# EAGLE schematic STM32F405RGT6 (EAGLE 9.6.2)
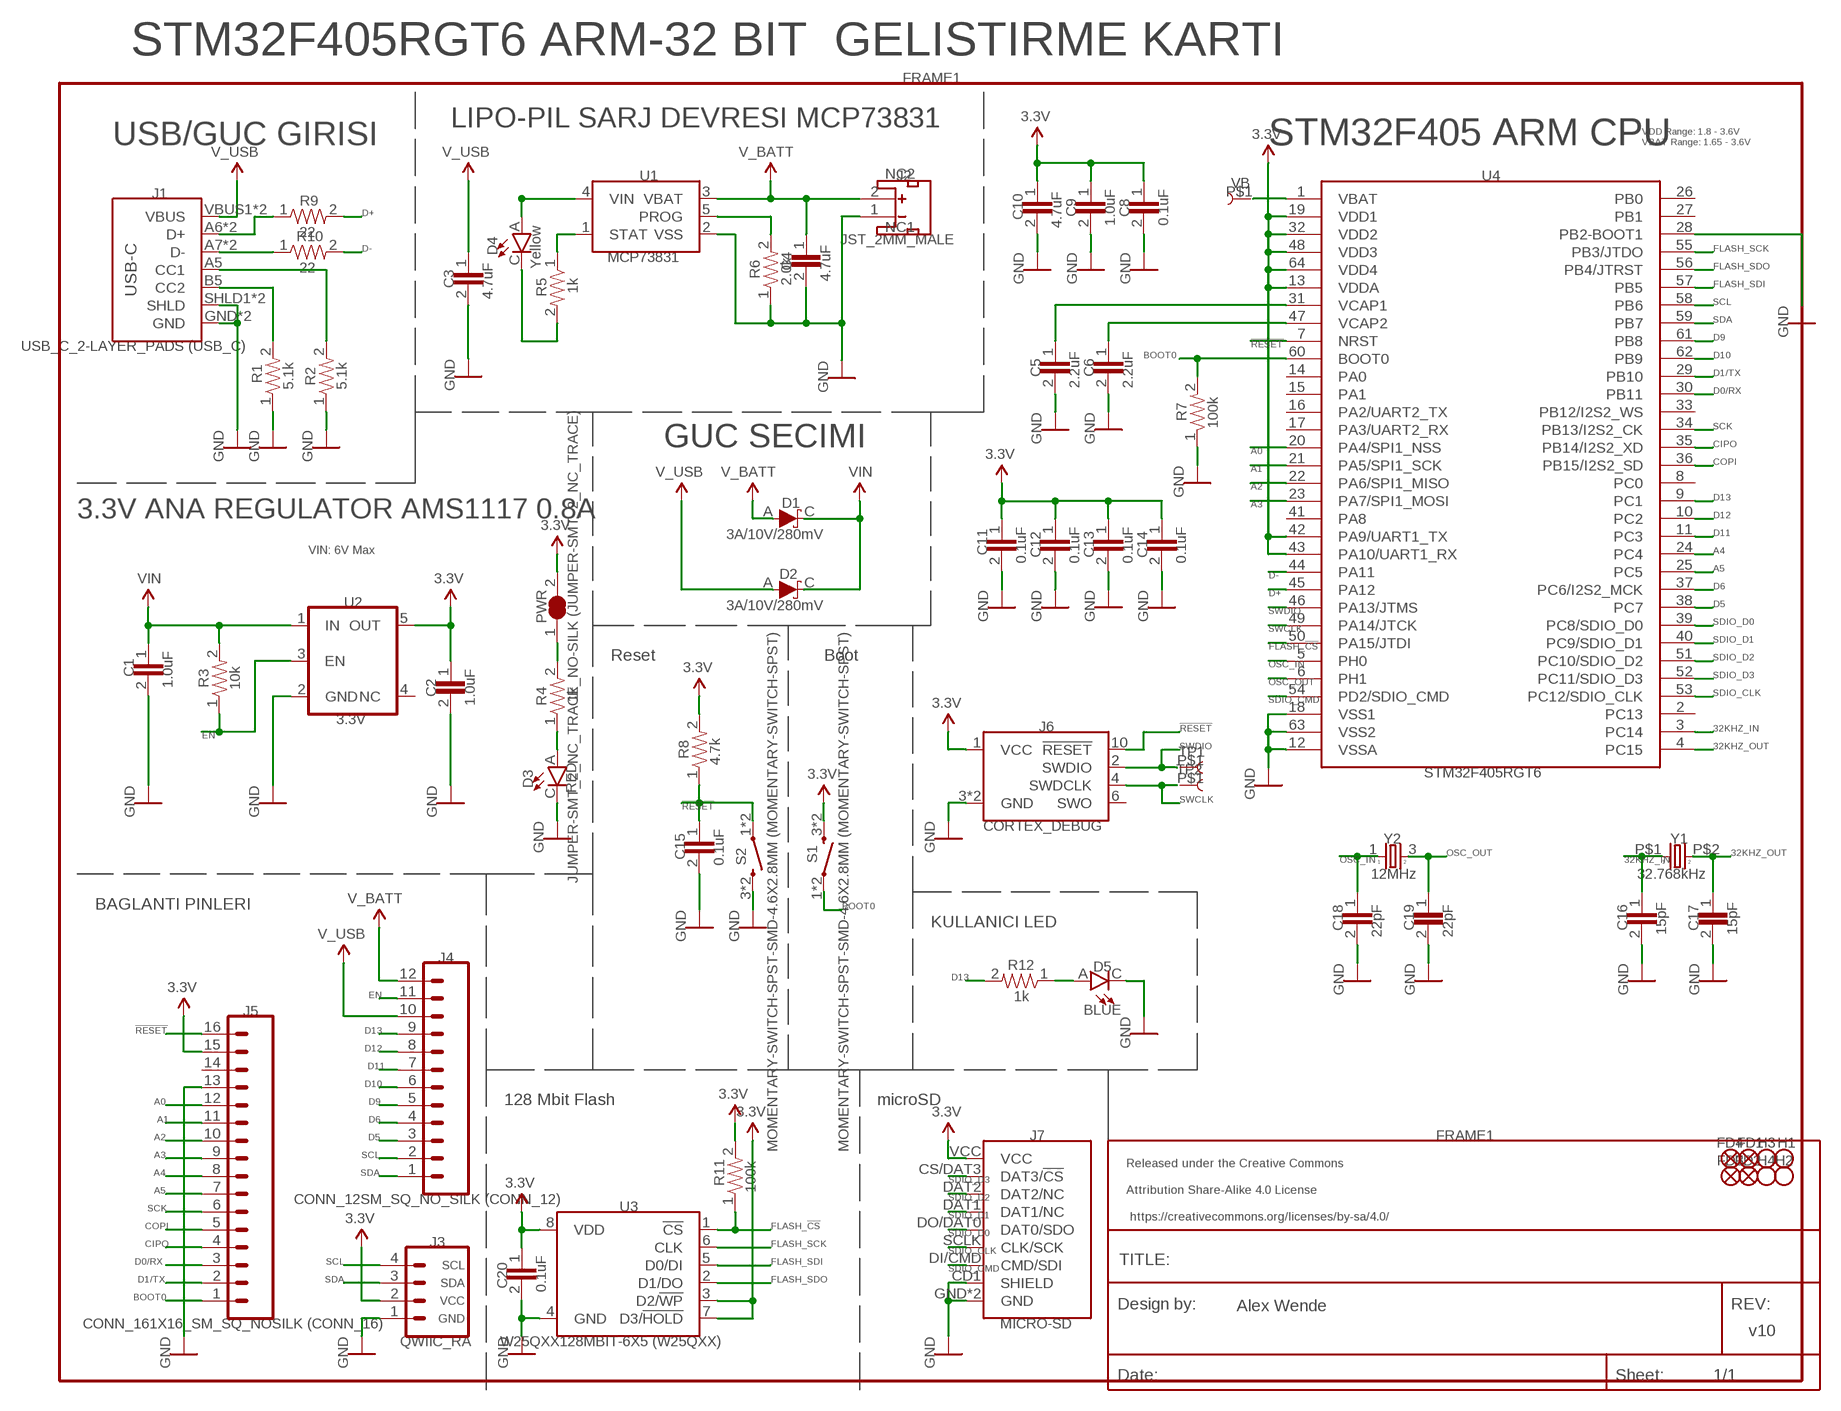
[diagram p0: schematic, sheet 1]

## Parts
C1  1.0uF  1.0UF-0402T-16V-10%_(1.0UF)  [0402-TIGHT]
C2  1.0uF  1.0UF-0402T-16V-10%_(1.0UF)_34  [0402-TIGHT]
C3  4.7uF  4.7UF-0402_TIGHT-6.3V-20%-X5R_(4.7UF)  [0402-TIGHT]
C4  4.7uF  4.7UF-0402_TIGHT-6.3V-20%-X5R_(4.7UF)_18  [0402-TIGHT]
C5  2.2uF  2.2UF-0402_TIGHT-10V-10%-X5R_(2.2UF)  [0402-TIGHT]
C6  2.2uF  2.2UF-0402_TIGHT-10V-10%-X5R_(2.2UF)  [0402-TIGHT]
C8  0.1uF  0.1UF-0402T-10V-10%-X7R_(0.1UF)  [0402-TIGHT]
C9  1.0uF  1.0UF-0402T-16V-10%_(1.0UF)  [0402-TIGHT]
C10  4.7uF  4.7UF-0402_TIGHT-6.3V-20%-X5R_(4.7UF)  [0402-TIGHT]
C11  0.1uF  0.1UF-0402T-10V-10%-X7R_(0.1UF)  [0402-TIGHT]
C12  0.1uF  0.1UF-0402T-10V-10%-X7R_(0.1UF)  [0402-TIGHT]
C13  0.1uF  0.1UF-0402T-10V-10%-X7R_(0.1UF)  [0402-TIGHT]
C14  0.1uF  0.1UF-0402T-10V-10%-X7R_(0.1UF)  [0402-TIGHT]
C15  0.1uF  0.1UF-0402T-10V-10%-X7R_(0.1UF)  [0402-TIGHT]
C16  15pF  15PF-0402T-50V-5%_(15PF)  [0402-TIGHT]
C17  15pF  15PF-0402T-50V-5%_(15PF)_42  [0402-TIGHT]
C18  22pF  22PF-0402T-16V-10%_(22PF)  [0402-TIGHT]
C19  22pF  22PF-0402T-16V-10%_(22PF)_9  [0402-TIGHT]
C20  0.1uF  0.1UF-0402T-10V-10%-X7R_(0.1UF)  [0402-TIGHT]
D1  3A/10V/280mV  DIODE-SCHOTTKY-BAT60A_(DIODE-SCHOTTKY)  [SOD-323]
D2  3A/10V/280mV  DIODE-SCHOTTKY-BAT60A_(DIODE-SCHOTTKY)  [SOD-323]
D3  RED  LED-RED0603_(LED-RED)  [LED-0603]
D4  Yellow  LED-YELLOW0603_(LED-YELLOW)  [LED-0603]
D5  BLUE  LED-BLUE0603_(LED-BLUE)  [LED-0603]
FD1  FIDUCIALUFIDUCIAL_(FIDUCIAL)  [FIDUCIAL-MICRO]
FD2  FIDUCIALUFIDUCIAL_(FIDUCIAL)  [FIDUCIAL-MICRO]
FD3  FIDUCIALUFIDUCIAL_(FIDUCIAL)  [FIDUCIAL-MICRO]
FD4  FIDUCIALUFIDUCIAL_(FIDUCIAL)  [FIDUCIAL-MICRO]
FRAME1  FRAME-LETTER  [CREATIVE_COMMONS]
H1  STAND-OFFTIGHT_(STAND-OFF)  [STAND-OFF-TIGHT]
H2  STAND-OFFTIGHT_(STAND-OFF)  [STAND-OFF-TIGHT]
H3  STAND-OFFTIGHT_(STAND-OFF)  [STAND-OFF-TIGHT]
H4  STAND-OFFTIGHT_(STAND-OFF)  [STAND-OFF-TIGHT]
J1  USB_C_2-LAYER_PADS_(USB_C)  [USB-C-16P-2LAYER-PADS]
J2  JST_2MM_MALE  [JST-2-SMD]
J3  QWIIC_RA  QWIIC_CONNECTORJS-1MM_(QWIIC_CONNECTOR)  [JST04_1MM_RA]
J4  CONN_12SM_SQ_NO_SILK_(CONN_12)  [1X12_SM_SQ_NOSILK]
J5  CONN_161X16_SM_SQ_NOSILK_(CONN_16)  [1X16_SM_SQ_NOSILK]
J6  CORTEX_DEBUG  CORTEX_JTAG_DEBUG_MINIMUM_PTH_NS_(CORTEX_JTAG_DEBUG_MINIMUM)  [2X5-PTH-1.27MM-NO_SILK]
J7  MICRO-SD  MICRO-SD-SDIOPUSH-PUSH_(MICRO-SD-SDIO)  [MICRO-SD-SOCKET]
PWR  JUMPER-SMT_2_NC_TRACE_NO-SILK_(JUMPER-SMT_2_NC_TRACE)  [SMT-JUMPER_2_NC_TRACE_NO-SILK]
R1  5.1k  5.1KOHM5.1KOHM-0603-1/10W-1%_(5.1KOHM)  [0603]
R2  5.1k  5.1KOHM5.1KOHM-0603-1/10W-1%_(5.1KOHM)  [0603]
R3  10k  10KOHM-0603-1/10W-1%_(10KOHM)  [0603]
R4  1k  1KOHM-0402T-1/16W-1%_(1KOHM)  [0402-TIGHT]
R5  1k  1KOHM-0402T-1/16W-1%_(1KOHM)  [0402-TIGHT]
R6  2.0k  2.0KOHM-0603-1/10W-5%_(2.0KOHM)  [0603]
R7  100k  100KOHM-0402T-1/16W-1%_(100KOHM)  [0402-TIGHT]
R8  4.7k  4.7KOHM-0603-1/10W-1%_(4.7KOHM)  [0603]
R9  22  22OHM-0603-1/10W-1%_(22OHM)  [0603]
R10  22  22OHM-0603-1/10W-1%_(22OHM)  [0603]
R11  100k  100KOHM-0402T-1/16W-1%_(100KOHM)_11  [0402-TIGHT]
R12  1k  1KOHM-0402T-1/16W-1%_(1KOHM)  [0402-TIGHT]
S1  MOMENTARY-SWITCH-SPST-SMD-4.6X2.8MM_(MOMENTARY-SWITCH-SPST)_40  [TACTILE_SWITCH_SMD_4.6X2.8MM]
S2  MOMENTARY-SWITCH-SPST-SMD-4.6X2.8MM_(MOMENTARY-SWITCH-SPST)  [TACTILE_SWITCH_SMD_4.6X2.8MM]
TP1  TEST-POINT3_(TEST-POINT)  [PAD.03X.03]
TP2  TEST-POINT3_(TEST-POINT)  [PAD.03X.03]
U1  MCP73831  [SOT23-5]
U2  3.3V  V_REG_AP2112K-3.3V_(V_REG_AP2112)  [SOT23-5]
U3  W25QXX128MBIT-6X5_(W25QXX)  [WSON-8-6X5]
U4  STM32F405RGT6  STM32F405RG  [TQFP64]
VB  TEST-POINT3_(TEST-POINT)  [PAD.03X.03]
Y1  32.768kHz  CRYSTAL-32.768KHZSMD-3.2X1.5_(CRYSTAL-32.768KHZ)  [CRYSTAL-SMD-3.2X1.5MM]
Y2  12MHz  CRYSTAL-12MHZ''_(CRYSTAL-12MHZ)  [CRYSTAL-SMD-5X3.2-4PAD]

## Nets
3.3V: C2.1 C8.1 C9.1 C10.1 C11.1 C12.1 C13.1 C14.1 C20.1 J3.2 J5.15 J6.1(VCC) J7.VCC PWR.2 R8.2 R11.2 S1.3 S1.4 U2.5(OUT) U3.3(D2/!WP!) U3.7(D3/!HOLD!) U3.8(VDD) U4.13(VDDA) U4.19(VDD1) U4.32(VDD2) U4.42(PA9/UART1_TX) U4.43(PA10/UART1_RX) U4.48(VDD3) U4.64(VDD4) ; supply symbol labelled 3.3V_28
32KHZ_IN: C16.1 U4.3(PC14) Y1.P$1
32KHZ_OUT: C17.1 U4.4(PC15) Y1.P$2
!RESET: C15.1 J5.16 J6.10(!RESET) R8.1 S2.1 S2.2 U4.7(NRST)
A0: J5.12 U4.20(PA4/SPI1_NSS)
A1: J5.11 U4.21(PA5/SPI1_SCK)
A2: J5.10 U4.22(PA6/SPI1_MISO)
A3: J5.9 U4.23(PA7/SPI1_MOSI)
A4: J5.8 U4.24(PC4)
A5: J5.7 U4.25(PC5)
BOOT0: J5.1 R7.2 S1.1 S1.2 U4.60(BOOT0)
CIPO: J5.4 U4.35(PB14/I2S2_XD)
COPI: J5.5 U4.36(PB15/I2S2_SD)
D0/RX: J5.3 U4.30(PB11)
D1/TX: J5.2 U4.29(PB10)
D5: J4.3 U4.38(PC7)
D6: J4.4 U4.37(PC6/I2S2_MCK)
D9: J4.5 U4.61(PB8)
D10: J4.6 U4.62(PB9)
D11: J4.7 U4.11(PC3)
D12: J4.8 U4.10(PC2)
D13: J4.9 R12.2 U4.9(PC1)
D+: R9.2 U4.45(PA12)
D-: R10.2 U4.44(PA11)
EN: J4.11 R3.1 U2.3(EN)
FLASH_!CS: R11.1 U3.1(!CS!) U4.50(PA15/JTDI)
FLASH_SCK: U3.6(CLK) U4.55(PB3/JTDO)
FLASH_SDI: U3.5(D0/DI) U4.57(PB5)
FLASH_SDO: U3.2(D1/DO) U4.56(PB4/JTRST)
GND: C1.2 C2.2 C3.2 C4.2 C5.2 C6.2 C8.2 C9.2 C10.2 C11.2 C12.2 C13.2 C14.2 C15.2 C16.2 C17.2 C18.2 C19.2 C20.2 D3.C D5.C J1.GND J1.GND2(GND) J1.SHLD1(SHLD) J1.SHLD2(SHLD) J2.1(-) J3.1 J5.13 J6.3(GND) J6.5(GND) J7.CD1(SHIELD) J7.GND J7.GND1(GND) R1.1 R2.1 R6.1 R7.1 S2.3 S2.4 U1.2(VSS) U2.2(GND) U3.4(GND) U4.12(VSSA) U4.18(VSS1) U4.28(PB2-BOOT1) U4.63(VSS2) ; supply symbol labelled GND_13
N$1: D5.A R12.1
N$2: PWR.1 R4.2
N$3: J1.A6(D+) J1.B6(D+) R9.1
N$6: J1.A7(D-) J1.B7(D-) R10.1
N$7: D3.A R4.1
N$8: R6.2 U1.5(PROG)
N$9: J1.A5(CC1) R2.2
N$10: J1.B5(CC2) R1.2
N$14: D4.C R5.2
N$15: R5.1 U1.1(STAT)
N$16: C5.1 U4.31(VCAP1)
N$18: C6.1 U4.47(VCAP2)
OSC_IN: C18.1 U4.5(PH0) Y2.1
OSC_OUT: C19.1 U4.6(PH1) Y2.3
SCK: J5.6 U4.34(PB13/I2S2_CK)
SCL: J3.4 J4.2 U4.58(PB6)
SDA: J3.3 J4.1 U4.59(PB7)
SDIO_CLK: J7.SCLK(CLK/SCK) U4.53(PC12/SDIO_CLK)
SDIO_CMD: J7.DI/CMD(CMD/SDI) U4.54(PD2/SDIO_CMD)
SDIO_D0: J7.DO/DAT0(DAT0/SDO) U4.39(PC8/SDIO_D0)
SDIO_D1: J7.DAT1(DAT1/NC) U4.40(PC9/SDIO_D1)
SDIO_D2: J7.DAT2(DAT2/NC) U4.51(PC10/SDIO_D2)
SDIO_D3: J7.CS/DAT3(DAT3/!CS!) U4.52(PC11/SDIO_D3)
SWCLK: J6.4(SWDCLK) TP2.P$1 U4.49(PA14/JTCK)
SWDIO: J6.2(SWDIO) TP1.P$1 U4.46(PA13/JTMS)
V_BATT: C4.1 D1.A J2.2(+) J4.12 U1.3(VBAT) ; supply symbol labelled V_BATT_16
V_USB: C3.1 D2.A D4.A J1.VBUS1(VBUS) J1.VBUS2(VBUS) J4.10 U1.4(VIN) ; supply symbol labelled V_USB_4
VB: U4.1(VBAT) VB.P$1
VIN: C1.1 D1.C D2.C R3.2 U2.1(IN)
Unconnected: J2.NC1(PAD1) J2.NC2(PAD2) J5.14 J6.6(SWO) U2.4(NC) U4.2(PC13) U4.8(PC0) U4.14(PA0) U4.15(PA1) U4.16(PA2/UART2_TX) U4.17(PA3/UART2_RX) U4.26(PB0) U4.27(PB1) U4.33(PB12/I2S2_WS) U4.41(PA8)

## Notes on the sheet
- STM32F405RGT6 ARM-32 BIT  GELISTIRME KARTI
- FRAME1
- 3.3V
- LIPO-PIL SARJ DEVRESI MCP73831
- 3.3V
- USB/GUC GIRISI | STM32F405 ARM CPU
- VDD Range: 1.8 - 3.6V
  VBAT Range: 1.65 - 3.6V
- V_USB | V_USB | V_BATT
- U1 | J2 | U4
- VB
- J1
- R9
- D+ | C10 | C9 | C8
- 22 | 4.7uF | 1.0uF | 0.1uF
- JST_2MM_MALE
- R10
- D- | MCP73831 | FLASH_SCK
- D4
- 22
- USB-C | Yellow | C4 | FLASH_SDO
- R6 | 4.7uF
- 2.0k | GND | GND | GND
- C3 | FLASH_SDI
- R5 | 1k
- 4.7uF
- SCL
- SDA
- USB_C_2-LAYER_PADS (USB_C) | GND
- !RESET | D9
- BOOT0 | D10
- C5 | C6 | D1/TX
- R1 | R2
- 5.1k | 5.1k | GND | 2.2uF | 2.2uF
- GND | D0/RX
- R7
- 100k | SCK
- GUC SECIMI | GND | GND
- A0 | CIPO
- GND | GND | GND | 3.3V
- A1 | COPI
- V_USB | V_BATT | VIN
- A2
- GND
- A3 | D13
- D1
- 3.3V ANA REGULATOR AMS1117 0.8A | D12
- 3.3V | 3A/10V/280mV
- D11
- VIN: 6V Max | C11 | C12 | C13 | C14 | A4
- 0.1uF | 0.1uF | 0.1uF | 0.1uF
- D- | A5
- D2
- VIN | 3.3V
- D+ | D6
- 3A/10V/280mV
- U2 | SWDIO | D5
- PWR | GND | GND | GND | GND
- SWCLK | SDIO_D0
- FLASH_!CS | SDIO_D1
- Reset | Boot | OSC_IN | SDIO_D2
- C1 | 3.3V
- OSC_OUT | SDIO_D3
- 1.0uF | R3 | 10k
- C2 | SDIO_CMD | SDIO_CLK
- 1.0uF | R4 | 1k
- 3.3V
- 3.3V
- EN | J6 | !RESET | 32KHZ_IN
- SWDIO | 32KHZ_OUT
- R8 | TP1
- 4.7k | STM32F405RGT6
- TP2
- 3.3V
- D3
- RED
- GND
- !RESET | SWCLK
- GND | GND | GND | CORTEX_DEBUG
- Y2 | Y1
- GND | GND
- OSC_IN | OSC_OUT | 32KHZ_IN | 32KHZ_OUT
- C15 | S1
- 0.1uF | S2 | 1 | 2 | 1 | 2
- 12MHz | 32.768kHz
- JUMPER-SMT_2_NC_TRACE_NO-SILK (JUMPER-SMT_2_NC_TRACE)
- V_BATT
- BAGLANTI PINLERI | BOOT0
- KULLANICI LED | C18 | C19 | C16 | C17
- 22pF | 22pF | 15pF | 15pF
- V_USB | GND | GND
- J4
- R12 | D5
- D13
- 3.3V | 1k | GND | GND | GND | GND
- EN
- BLUE
- J5
- !RESET | D13
- GND
- D12
- D11
- D10
- 3.3V
- A0 | D9 | 128 Mbit Flash | microSD
- 3.3V | 3.3V
- A1 | D6
- A2 | D5 | J7 | FRAME1
- MOMENTARY-SWITCH-SPST-SMD-4.6X2.8MM (MOMENTARY-SWITCH-SPST) | MOMENTARY-SWITCH-SPST-SMD-4.6X2.8MM (MOMENTARY-SWITCH-SPST) | FD4 | FD1 | H3 | H1
- A3 | SCL
- Released under the Creative Commons | FD3 | FD2 | H4 | H2
- A4 | SDA | SDIO_D3
- 3.3V | R11
- A5 | CONN_12SM_SQ_NO_SILK (CONN_12) | 100k | SDIO_D2 | Attribution Share-Alike 4.0 License
- SCK | U3 | SDIO_D1
- 3.3V | https://creativecommons.org/licenses/by-sa/4.0/
- COPI | FLASH_!CS | SDIO_D0
- CIPO | J3 | FLASH_SCK | SDIO_CLK
- D0/RX | SCL | SCL | FLASH_SDI | SDIO_CMD | TITLE:
- D1/TX | SDA | SDA | FLASH_SDO
- C20 | 0.1uF
- BOOT0 | VCC
- Design by: | Alex Wende | REV:
- CONN_161X16_SM_SQ_NOSILK (CONN_16) | GND | MICRO-SD
- QWIIC_RA | W25QXX128MBIT-6X5 (W25QXX) | v10
- GND | GND | GND | GND
- Date: | Sheet: | 1/1

## Library data of the parts
C1 C9 = common:1.0UF-0402T-16V-10%_(1.0UF); PROD_ID: CAP-12417
C2 = common:1.0UF-0402T-16V-10%_(1.0UF)_34; PROD_ID: CAP-12417
C3 C10 = common:4.7UF-0402_TIGHT-6.3V-20%-X5R_(4.7UF); PROD_ID: CAP-14240
C4 = common:4.7UF-0402_TIGHT-6.3V-20%-X5R_(4.7UF)_18; PROD_ID: CAP-14240
C5 C6 = common:2.2UF-0402_TIGHT-10V-10%-X5R_(2.2UF); PROD_ID: CAP-14232
C8 C11-C15 C20 = common:0.1UF-0402T-10V-10%-X7R_(0.1UF); PROD_ID: CAP-15083
C16 = common:15PF-0402T-50V-5%_(15PF); PROD_ID: CAP-13063
C17 = common:15PF-0402T-50V-5%_(15PF)_42; PROD_ID: CAP-13063
C18 = common:22PF-0402T-16V-10%_(22PF); PROD_ID: CAP-14674
C19 = common:22PF-0402T-16V-10%_(22PF)_9; PROD_ID: CAP-14674
D1 D2 = common:DIODE-SCHOTTKY-BAT60A_(DIODE-SCHOTTKY); PROD_ID: DIO-14072
D3 = common:LED-RED0603_(LED-RED); PROD_ID: DIO-00819
D4 = common:LED-YELLOW0603_(LED-YELLOW); PROD_ID: DIO-09003
D5 = common:LED-BLUE0603_(LED-BLUE); PROD_ID: DIO-08575
FD1-FD4 = common:FIDUCIALUFIDUCIAL_(FIDUCIAL)
FRAME1 = common:FRAME-LETTER
H1-H4 = common:STAND-OFFTIGHT_(STAND-OFF)
J1 = common:USB_C_2-LAYER_PADS_(USB_C); PROD_ID: CONN-14122
J2 = common:JST_2MM_MALE; PROD_ID: CONN-11443; SF_ID: PRT-08612
J3 = common:QWIIC_CONNECTORJS-1MM_(QWIIC_CONNECTOR); PROD_ID: CONN-13694
J4 = common:CONN_12SM_SQ_NO_SILK_(CONN_12)
J5 = common:CONN_161X16_SM_SQ_NOSILK_(CONN_16)
J6 = common:CORTEX_JTAG_DEBUG_MINIMUM_PTH_NS_(CORTEX_JTAG_DEBUG_MINIMUM)
J7 = common:MICRO-SD-SDIOPUSH-PUSH_(MICRO-SD-SDIO); PROD_ID: CONN-07820
PWR = common:JUMPER-SMT_2_NC_TRACE_NO-SILK_(JUMPER-SMT_2_NC_TRACE)
R1 R2 = common:5.1KOHM5.1KOHM-0603-1/10W-1%_(5.1KOHM); PROD_ID: RES-12083
R3 = common:10KOHM-0603-1/10W-1%_(10KOHM); PROD_ID: RES-00824
R4 R5 R12 = common:1KOHM-0402T-1/16W-1%_(1KOHM); PROD_ID: RES-14342
R6 = common:2.0KOHM-0603-1/10W-5%_(2.0KOHM); PROD_ID: RES-08296
R7 = common:100KOHM-0402T-1/16W-1%_(100KOHM); PROD_ID: RES-13495
R8 = common:4.7KOHM-0603-1/10W-1%_(4.7KOHM); PROD_ID: RES-07857
R9 R10 = common:22OHM-0603-1/10W-1%_(22OHM); PROD_ID: RES-08698
R11 = common:100KOHM-0402T-1/16W-1%_(100KOHM)_11; PROD_ID: RES-13495
S1 = common:MOMENTARY-SWITCH-SPST-SMD-4.6X2.8MM_(MOMENTARY-SWITCH-SPST)_40; PROD_ID: SWCH-13065
S2 = common:MOMENTARY-SWITCH-SPST-SMD-4.6X2.8MM_(MOMENTARY-SWITCH-SPST); PROD_ID: SWCH-13065
TP1 TP2 VB = common:TEST-POINT3_(TEST-POINT)
U1 = common:MCP73831; PROD_ID: IC-09995
U2 = common:V_REG_AP2112K-3.3V_(V_REG_AP2112); PROD_ID: VREG-12457
U3 = common:W25QXX128MBIT-6X5_(W25QXX); PROD_ID: IC-15107
U4 = common:STM32F405RG; PROD_ID: IC-11709
Y1 = common:CRYSTAL-32.768KHZSMD-3.2X1.5_(CRYSTAL-32.768KHZ); PROD_ID: XTAL-13062
Y2 = common:CRYSTAL-12MHZ''_(CRYSTAL-12MHZ); PROD_ID: XTAL-08297

## Net classes
1 power: width 0.762 mm